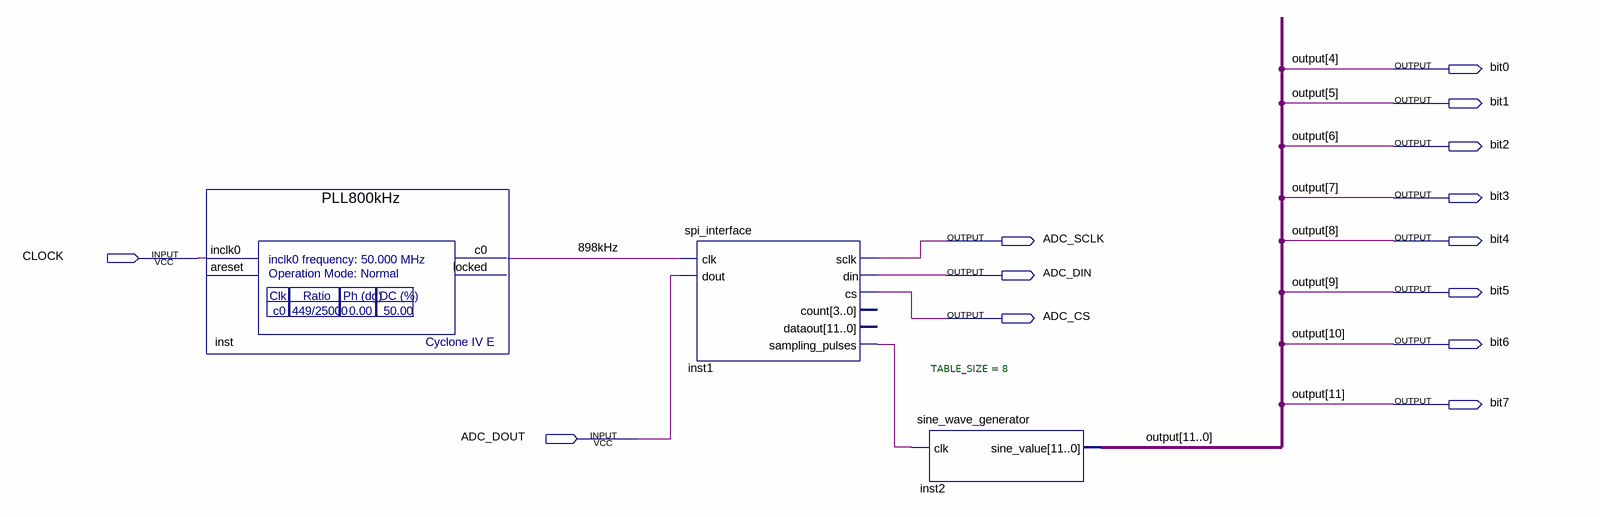
[diagram p0: schematic sheet]
// Quartus schematic ADC_digitising.bdf as structural Verilog: 3 symbols, 13 pins
module ADC_digitising (
  input  CLOCK,
  input  ADC_DOUT,
  output bit0,
  output bit1,
  output bit2,
  output bit3,
  output ADC_SCLK,
  output bit4,
  output ADC_DIN,
  output bit5,
  output ADC_CS,
  output bit6,
  output bit7
);

  wire \898kHz , inst1_sampling_pulses;
  wire [3:0] \output ;

  PLL800kHz inst (.inclk0(CLOCK), .c0(\898kHz ));  // open: areset, locked
  spi_interface inst1 (
    .clk(\898kHz ), .dout(ADC_DOUT), .sclk(ADC_SCLK), .din(ADC_DIN), .cs(ADC_CS),
    .sampling_pulses(inst1_sampling_pulses));  // open: count, dataout
  sine_wave_generator #(.TABLE_SIZE(8)) inst2 (
    .clk(inst1_sampling_pulses), .sine_value({bit7, bit6, bit5, bit4, bit3, bit2, bit1, bit0, \output }));

  // Other names for the same wires on the sheet: output[11:4] = {bit7, bit6, bit5, bit4, bit3, bit2, bit1, bit0}
endmodule
